# Altium schematic sheet main.SchDoc
size B; SheetNumber: 1; SheetTotal: 1
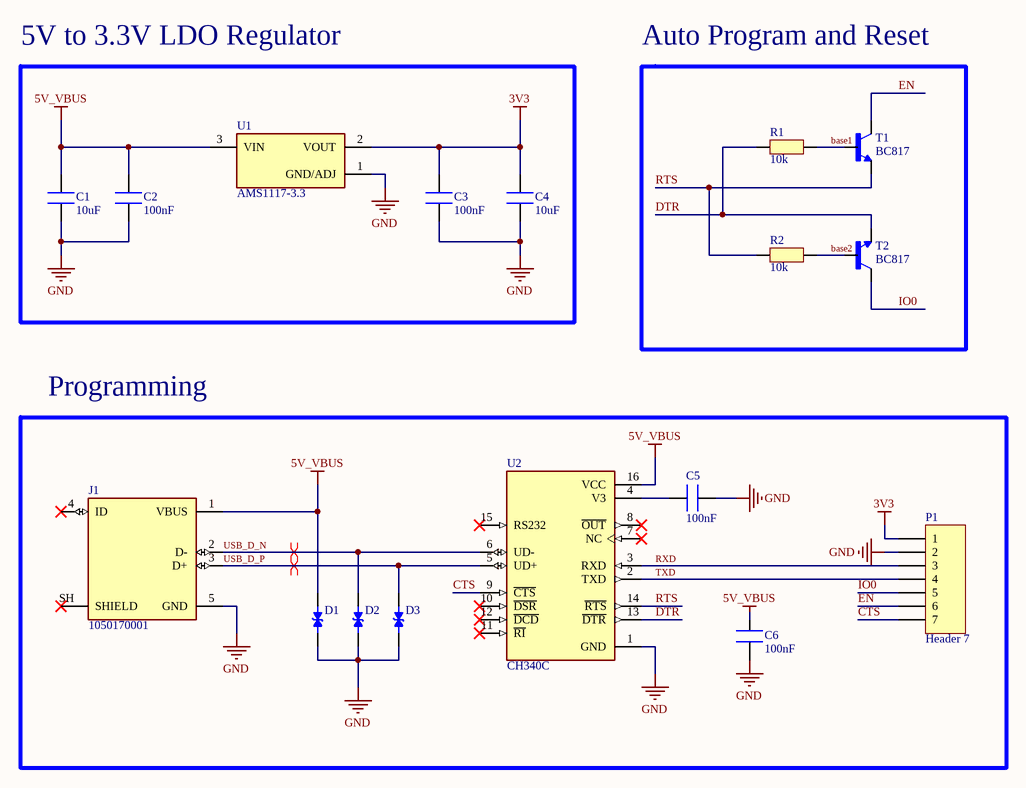
[diagram p0: main.SchDoc]

## Parts
C1  10uF  [CAP_0603]
C2  100nF  [CAP_0603]
C3  100nF  [CAP_0603]
C4  10uF  [CAP_0603]
C5  100nF  [CAP_0603]
C6  100nF  [CAP_0603]
D1  LESD5D5.0CT1G  [TVS_LESD5D5.0CT1G]  (value not drawn)
D2  LESD5D5.0CT1G  [TVS_LESD5D5.0CT1G]  (value not drawn)
D3  LESD5D5.0CT1G  [TVS_LESD5D5.0CT1G]  (value not drawn)
J1  1050170001  [MOLEX-1050170001]
P1  Header 7  [HDR1X7]
R1  10k  [RES_0603]
R2  10k  [RES_0603]
T1  BC817  [BJT_SOT-23-3_NPN]
T2  BC817  [BJT_SOT-23-3_NPN]
U1  AMS1117-3.3  [SOT229P700X180-4N]
U2  CH340C  [CH340x-SOP16]

## Blocks framed on the sheet
5V to 3.3V LDO Regulator: C1-C4 U1
Auto Program and Reset: R1 R2 T1 T2
Programming: C5 C6 D1-D3 J1 P1 U2

## Nets
3V3: C3.2 C4.2 P1.1 U1.2(VOUT)
5V_VBUS: C1.2 C2.2 C6.1 D1.2 J1.1(VBUS) U1.3(VIN) U2.16(VCC)
GND: C1.1 C2.1 C3.1 C4.1 C5.1 C6.2 D1.1 D2.1 D3.1 J1.5(GND) P1.2 U1.1(GND/ADJ) U2.1(GND)
base1: R1.2 T1.1(B)
base2: R2.2 T2.1(B)
CTS: P1.7 U2.9(~{CTS})
DTR: R1.1 T2.2(E) U2.13(~{DTR})
EN: P1.6 T1.3(C)
IO0: P1.5 T2.3(C)
RTS: R2.1 T1.2(E) U2.14(~{RTS})
RXD: P1.3 U2.3(RXD)
TXD: P1.4 U2.2(TXD)
USB_D_N: D2.2 J1.2(D-) U2.6(UD-)
USB_D_P: D3.2 J1.3(D+) U2.5(UD+)
NetC5_2: C5.2 U2.4(V3)

Not connected (* = marked no-connect by the designer): J1 4(ID)* SH(SHIELD)*; U2 7(NC)* 8(~{OUT})* 10(~{DSR})* 11(~{RI})* 12(~{DCD})* 15(RS232)*

## Layout directives
differential pair: USB_D_N, USB_D_P

## Notes on the sheet
- Labels drawn without touching a wire or pin: insert logo
- Project =
- Version =
- Sheet
- of
- Author:
- Link:
- Date:
- Checked by:

## Library data of the parts
C1-C6 = Cap_0603: Capacitor SMD 0603 Generic
D1-D3 = TVSDiode: SOD-523 ESD Protection Devices ROHS / VRWM = 5V / VC = 11.6V / C = 15pF General Purpose speed
J1 = Molex_1050170001: USB - micro B USB 2.0 Receptacle Connector 5 Position Surface Mount, Right Angle; Through Hole
P1 = Header 7: Header, 7-Pin; LatestRevisionDate: 17-Jul-2002; LatestRevisionNote: Re-released for DXP Platform.; Publisher: Altium Limited
R1 R2 = Res_0603: Resistor SMD 0603 Generic
T1 T2 = BJT_SOT23-3: BJT NPN Transistor SOT23-3 pkg
U1 = AMS1117-3.3: Sot223/Pkg 1-Amp 3.3-Volt Low Drop Out Voltage Regulatator
U2 = CH340C: 2Mbps Transceiver USB 2.0 SOP-16 USB ICs ROHS